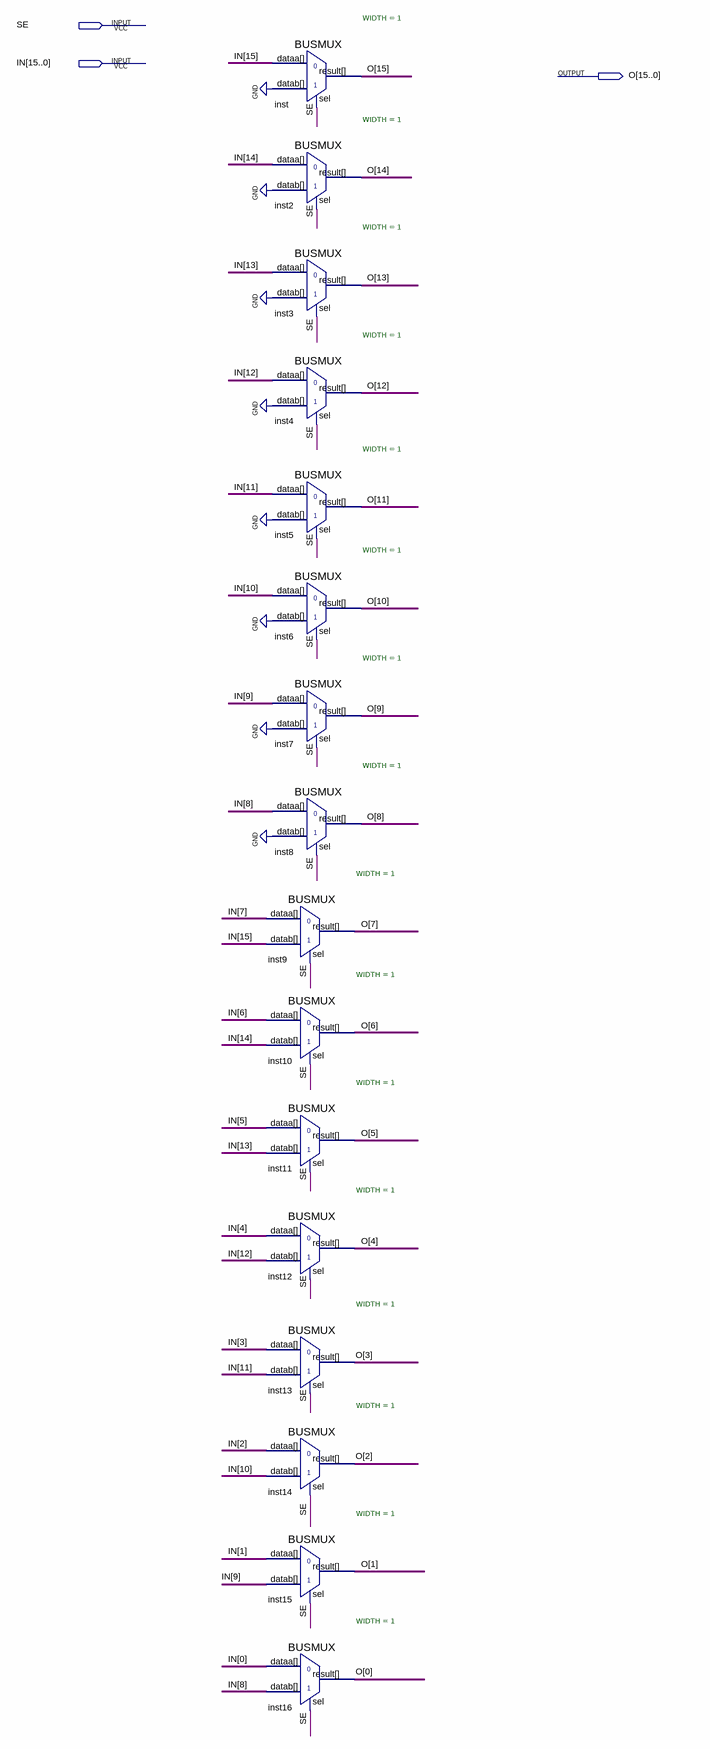
[diagram p0: schematic sheet]
// Quartus schematic SHIFT8BIT.bdf as structural Verilog: 16 symbols, 3 pins
module SHIFT8BIT (
  input  SE,
  input  [15:0] IN,
  output [15:0] O
);

  BUSMUX #(.WIDTH(1)) inst (.datab(1'b0), .sel(SE), .dataa(IN[15]), .result(O[15]));
  BUSMUX #(.WIDTH(1)) inst2 (.datab(1'b0), .sel(SE), .dataa(IN[14]), .result(O[14]));
  BUSMUX #(.WIDTH(1)) inst3 (.datab(1'b0), .sel(SE), .dataa(IN[13]), .result(O[13]));
  BUSMUX #(.WIDTH(1)) inst4 (.datab(1'b0), .sel(SE), .dataa(IN[12]), .result(O[12]));
  BUSMUX #(.WIDTH(1)) inst5 (.datab(1'b0), .sel(SE), .dataa(IN[11]), .result(O[11]));
  BUSMUX #(.WIDTH(1)) inst6 (.datab(1'b0), .sel(SE), .dataa(IN[10]), .result(O[10]));
  BUSMUX #(.WIDTH(1)) inst7 (.datab(1'b0), .sel(SE), .dataa(IN[9]), .result(O[9]));
  BUSMUX #(.WIDTH(1)) inst8 (.datab(1'b0), .sel(SE), .dataa(IN[8]), .result(O[8]));
  BUSMUX #(.WIDTH(1)) inst9 (.datab(IN[15]), .sel(SE), .dataa(IN[7]), .result(O[7]));
  BUSMUX #(.WIDTH(1)) inst10 (.datab(IN[14]), .sel(SE), .dataa(IN[6]), .result(O[6]));
  BUSMUX #(.WIDTH(1)) inst11 (.datab(IN[13]), .sel(SE), .dataa(IN[5]), .result(O[5]));
  BUSMUX #(.WIDTH(1)) inst12 (.datab(IN[12]), .sel(SE), .dataa(IN[4]), .result(O[4]));
  BUSMUX #(.WIDTH(1)) inst13 (.datab(IN[11]), .sel(SE), .dataa(IN[3]), .result(O[3]));
  BUSMUX #(.WIDTH(1)) inst14 (.datab(IN[10]), .sel(SE), .dataa(IN[2]), .result(O[2]));
  BUSMUX #(.WIDTH(1)) inst15 (.datab(IN[9]), .sel(SE), .dataa(IN[1]), .result(O[1]));
  BUSMUX #(.WIDTH(1)) inst16 (.datab(IN[8]), .sel(SE), .dataa(IN[0]), .result(O[0]));
endmodule
